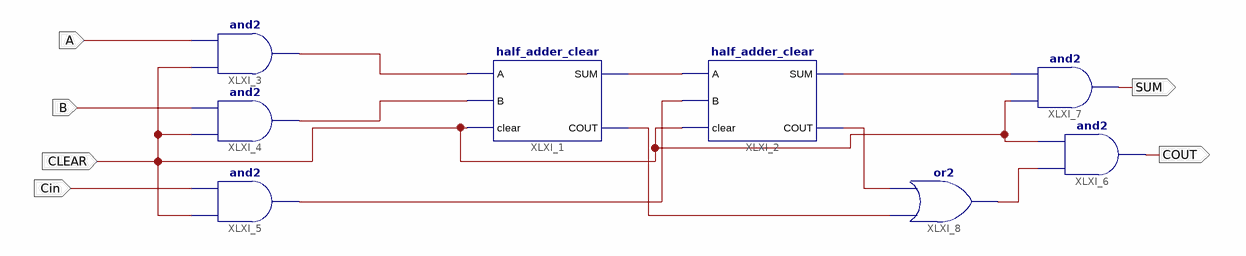
[diagram p0: schematic sheet 1]
// Xilinx ISE schematic fulladderusinghalfadder.sch (artix7) as structural Verilog: 8 symbols, 6 ports
module fulladderusinghalfadder (
  input  CLEAR,
  input  A,
  input  B,
  input  Cin,
  output SUM,
  output COUT
);

  wire XLXN_1, XLXN_2, XLXN_9, XLXN_10, XLXN_11, XLXN_12, XLXN_15, XLXN_16;

  half_adder_clear XLXI_1 (.A(XLXN_1), .B(XLXN_2), .clear(CLEAR), .SUM(XLXN_10), .COUT(XLXN_11));
  half_adder_clear XLXI_2 (.A(XLXN_10), .B(XLXN_9), .clear(CLEAR), .SUM(XLXN_16), .COUT(XLXN_12));
  and XLXI_3 (XLXN_1, CLEAR, A);
  and XLXI_4 (XLXN_2, CLEAR, B);
  and XLXI_5 (XLXN_9, CLEAR, Cin);
  and XLXI_6 (COUT, XLXN_15, CLEAR);
  and XLXI_7 (SUM, CLEAR, XLXN_16);
  or XLXI_8 (XLXN_15, XLXN_11, XLXN_12);
endmodule
